# EAGLE schematic Graphic LCD Backpack-v15 (EAGLE 6.4)

## Sheet 1 of 2
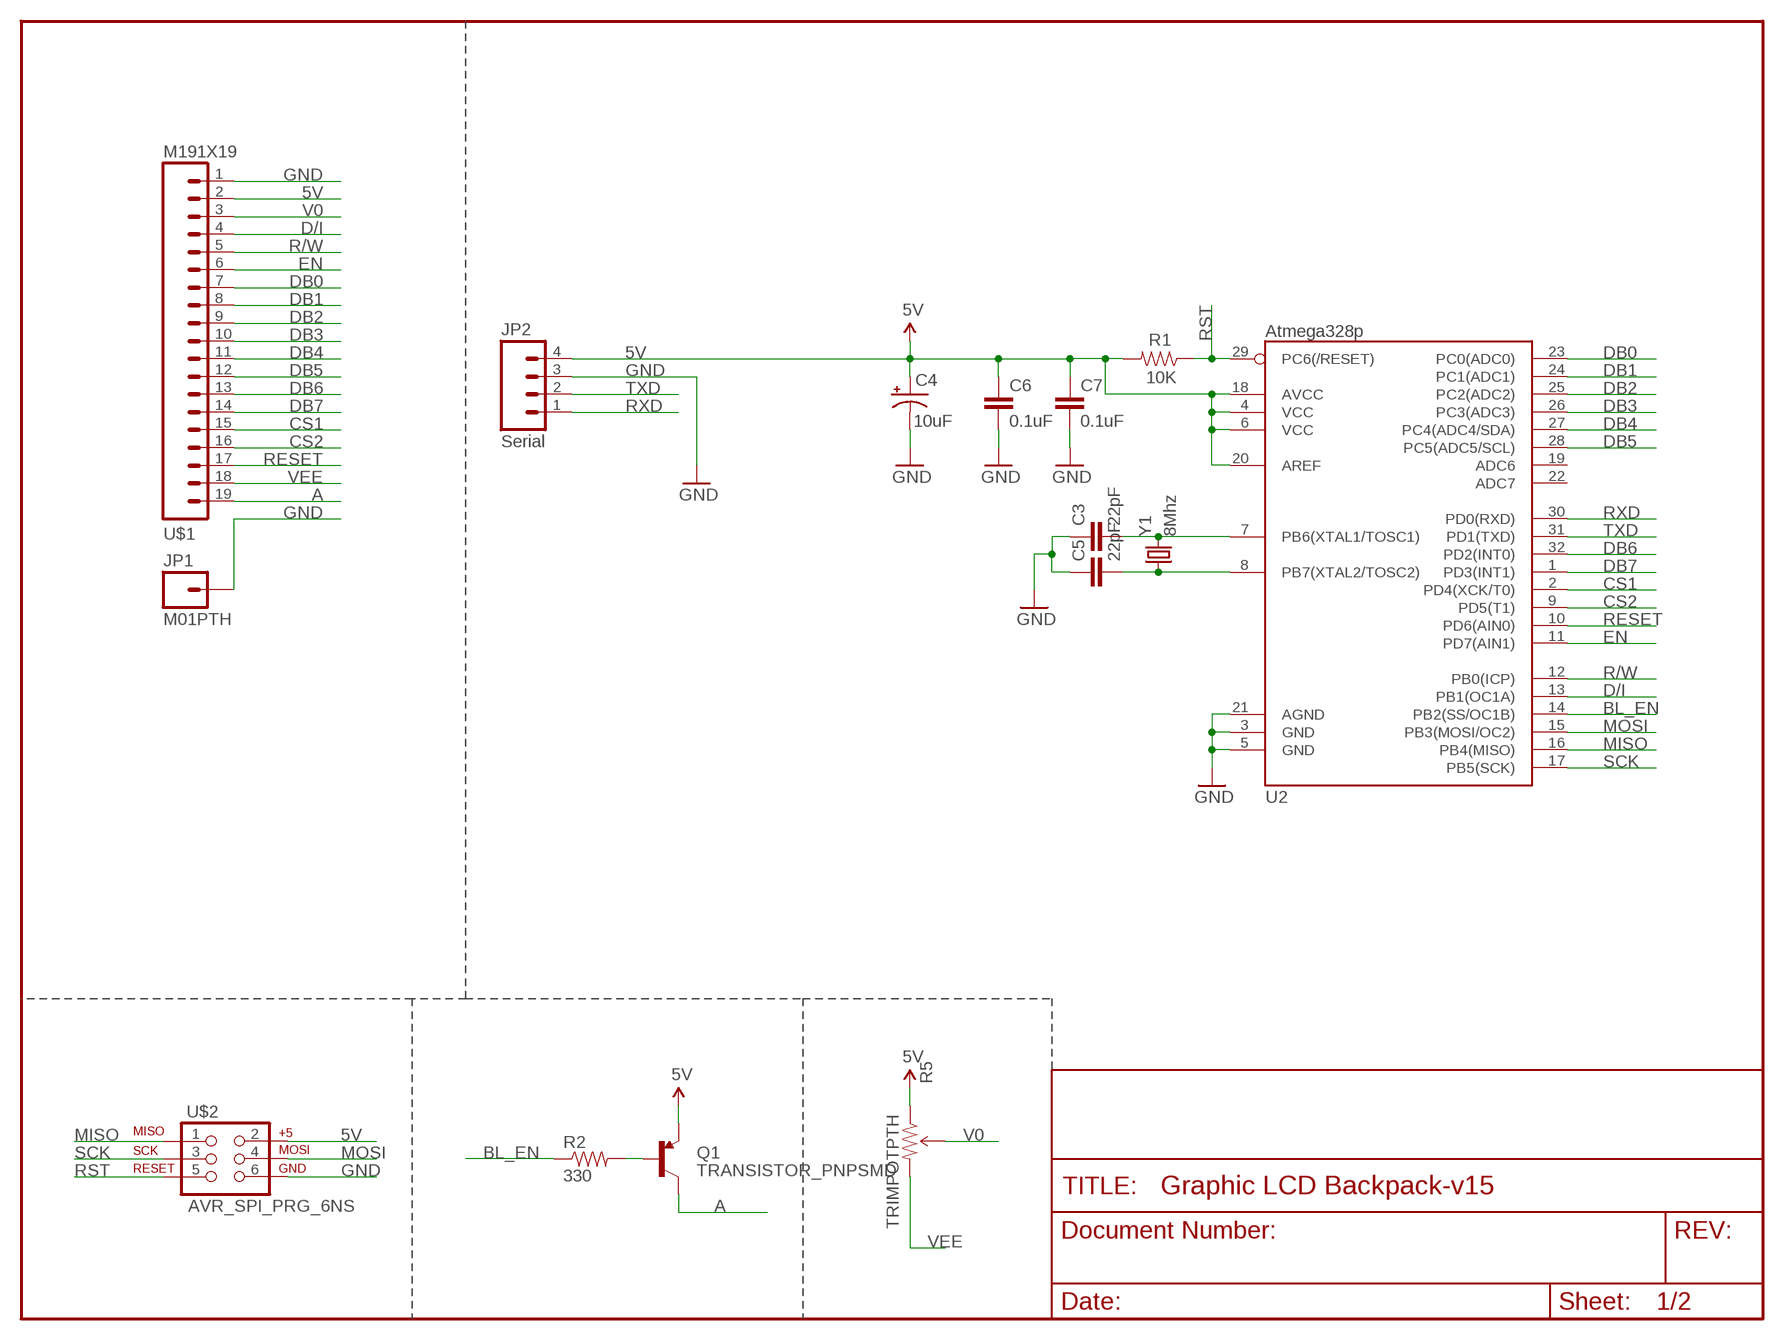
[diagram p0: schematic, sheet 1]

### Parts
C3  22pF  CAP1206  [1206]
C4  10uF  CAP_POL1206  [EIA3216]
C5  22pF  CAP1206  [1206]
C6  0.1uF  CAP1206  [1206]
C7  0.1uF  CAP1206  [1206]
JP1  M01PTH  [1X01]
JP2  Serial  M04PTH  [1X04]
Q1  TRANSISTOR_PNPSMD  [SOT23-3]
R1  10K  RESISTOR  [0805]
R2  330  RESISTOR  [0805]
R5  TRIMPOTPTH  [TRIM_POT_PTH]
U2  Atmega328p  ATMEGA328_SMT  [TQFP32-08]
U$1  M191X19  [1X19]
U$2  AVR_SPI_PRG_6NS  [2X3-NS]
Y1  8Mhz  CRYSTALHC49US  [HC49US]

### Nets
5V: C4.A(+) C6.1 C7.1 JP2.4 Q1.2(E) R1.2 R5.1(CCW) U2.4(VCC) U2.6(VCC) U2.18(AVCC) U2.20(AREF) U$1.2 U$2.2
A: Q1.3(C) U$1.19
BL_EN: R2.1 U2.14(PB2(SS/OC1B))
CS1: U2.2(PD4(XCK/T0)) U$1.15
CS2: U2.9(PD5(T1)) U$1.16
D/I: U2.13(PB1(OC1A)) U$1.4
DB0: U2.23(PC0(ADC0)) U$1.7
DB1: U2.24(PC1(ADC1)) U$1.8
DB2: U2.25(PC2(ADC2)) U$1.9
DB3: U2.26(PC3(ADC3)) U$1.10
DB4: U2.27(PC4(ADC4/SDA)) U$1.11
DB5: U2.28(PC5(ADC5/SCL)) U$1.12
DB6: U2.32(PD2(INT0)) U$1.13
DB7: U2.1(PD3(INT1)) U$1.14
EN: U2.11(PD7(AIN1)) U$1.6
GND: C3.1 C4.C(-) C5.1 C6.2 C7.2 JP1.1 JP2.3 U2.3(GND) U2.5(GND) U2.21(AGND) U$1.1 U$2.6 ; also sheet 2
MISO: U2.16(PB4(MISO)) U$2.1
MOSI: U2.15(PB3(MOSI/OC2)) U$2.4
N$1: Q1.1(B) R2.2
N$2: C3.2 U2.7(PB6(XTAL1/TOSC1)) Y1.2
N$3: C5.2 U2.8(PB7(XTAL2/TOSC2)) Y1.1
R/W: U2.12(PB0(ICP)) U$1.5
RESET: U2.10(PD6(AIN0)) U$1.17
RST: R1.1 U2.29(PC6(/RESET)) U$2.5
RXD: JP2.1 U2.30(PD0(RXD))
SCK: U2.17(PB5(SCK)) U$2.3
TXD: JP2.2 U2.31(PD1(TXD))
V0: R5.2(WIPER) U$1.3
VEE: R5.3(CW) U$1.18
Unconnected: U2.19(ADC6) U2.22(ADC7)

## Sheet 2 of 2
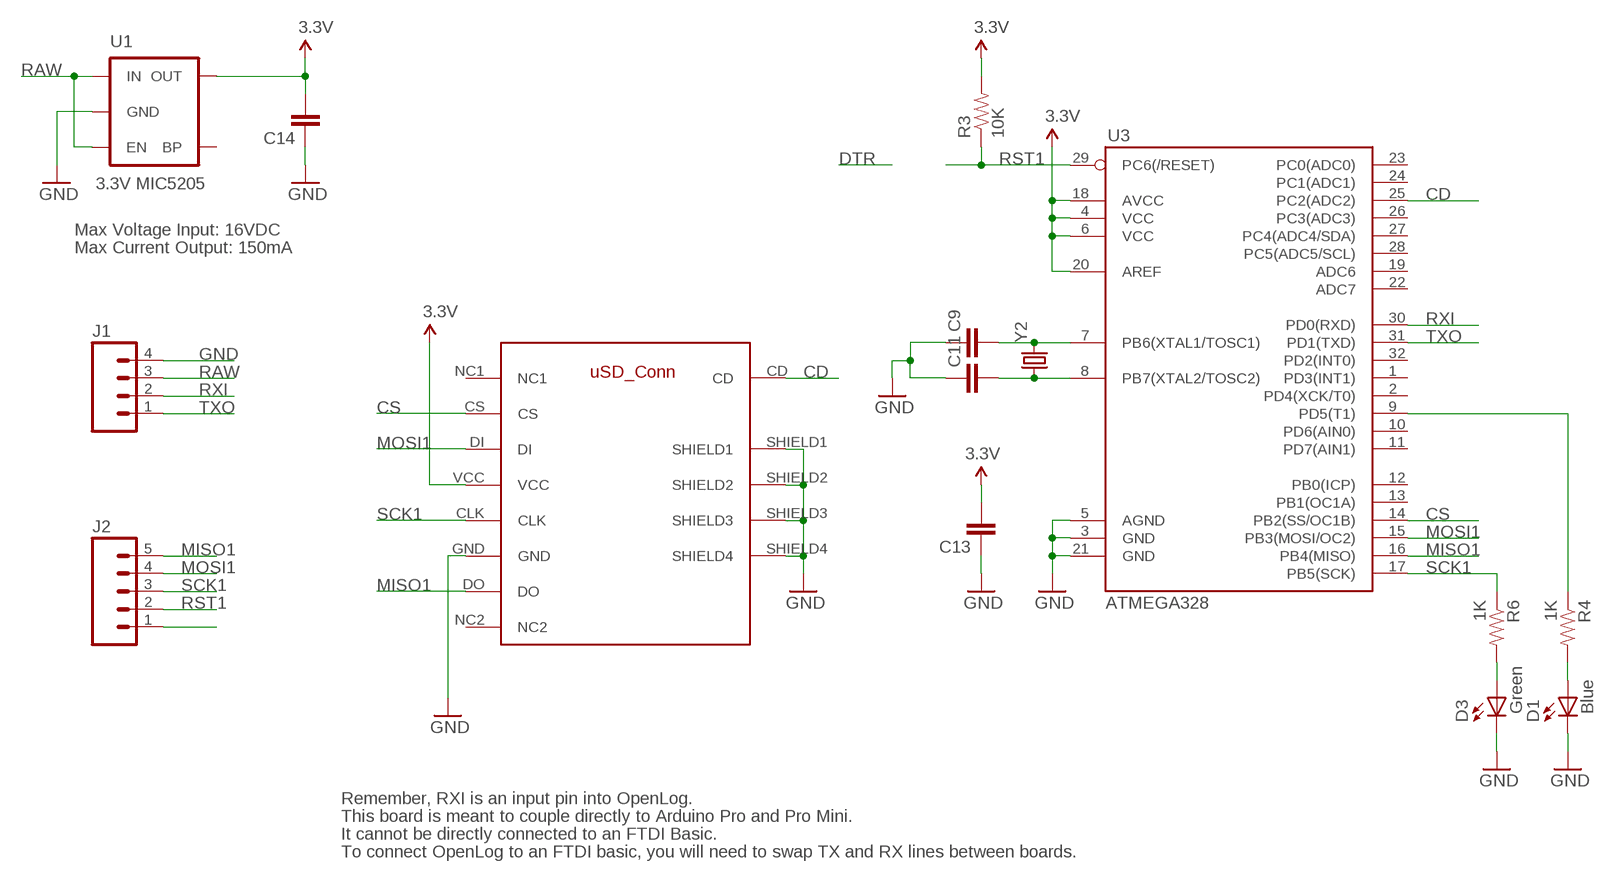
[diagram p1: schematic, sheet 2]

### Parts
C9  CAP1206  [1206]
C11  CAP1206  [1206]
C13  CAP1206  [1206]
C14  CAP1206  [1206]
D1  Blue  LED1206  [LED-1206]
D3  Green  LED1206  [LED-1206]
J1  M04PTH  [1X04]
J2  M05PTH  [1X05]
R3  10K  RESISTOR  [0805]
R4  1K  RESISTOR  [0805]
R6  1K  RESISTOR  [0805]
U1  3.3V MIC5205  V_REG_LDOSMD  [SOT23-5]
U3  ATMEGA328  ATMEGA168  [TQFP32-08]
U$3  USD_CONN  [USD_CONN]
Y2  CRYSTALHC49US  [HC49US]

### Nets
3.3V: C13.2 C14.2 R3.2 U1.5(OUT) U3.4(VCC) U3.6(VCC) U3.18(AVCC) U3.20(AREF) U$3.VCC
CD: U3.25(PC2(ADC2)) U$3.CD
CS: U3.14(PB2(SS/OC1B)) U$3.CS
GND: C9.1 C11.1 C13.1 C14.1 D1.C D3.C J1.4 J2.1 U1.2(GND) U3.3(GND) U3.5(AGND) U3.21(GND) U$3.GND U$3.SHIELD1 U$3.SHIELD2 U$3.SHIELD3 U$3.SHIELD4 ; also sheet 1
MISO1: J2.5 U3.16(PB4(MISO)) U$3.DO
MOSI1: J2.4 U3.15(PB3(MOSI/OC2)) U$3.DI
N$6: D1.A R4.2
N$7: D3.A R6.2
N$8: R4.1 U3.9(PD5(T1))
N$9: C9.2 U3.7(PB6(XTAL1/TOSC1)) Y2.2
N$10: C11.2 U3.8(PB7(XTAL2/TOSC2)) Y2.1
RAW [vcc]: J1.3 U1.1(IN) U1.3(EN)
RST1: J2.2 R3.1 U3.29(PC6(/RESET))
RXI: J1.2 U3.30(PD0(RXD))
SCK1: J2.3 R6.1 U3.17(PB5(SCK)) U$3.CLK
TXO: J1.1 U3.31(PD1(TXD))
Unconnected: U1.4(BP) U3.1(PD3(INT1)) U3.2(PD4(XCK/T0)) U3.10(PD6(AIN0)) U3.11(PD7(AIN1)) U3.12(PB0(ICP)) U3.13(PB1(OC1A)) U3.19(ADC6) U3.22(ADC7) U3.23(PC0(ADC0)) U3.24(PC1(ADC1)) U3.26(PC3(ADC3)) U3.27(PC4(ADC4/SDA)) U3.28(PC5(ADC5/SCL)) U3.32(PD2(INT0)) U$3.NC1 U$3.NC2

### Notes on the sheet
- Max Voltage Input: 16VDC
- Max Current Output: 150mA
- Remember, RXI is an input pin into OpenLog.
- This board is meant to couple directly to Arduino Pro and Pro Mini.
- It cannot be directly connected to an FTDI Basic.
- To connect OpenLog to an FTDI basic, you will need to swap TX and RX lines between boards.

## Library data of the parts
C3 C5-C7 C9 C11 C13 C14 = SparkFun-Capacitors:CAP: Capacitor Standard 0603 ceramic capacitor, and 0.1" leaded capacitor.
C4 = SparkFun:CAP_POL: Capacitor Polarized These are standard SMD and PTH capacitors. Normally 10uF, 47uF, and 100uF in electrolytic and tantalum varieties. Always verify the external diameter of the through hole cap, it varies with capacity, voltage, and manufacturer. The EIA devices should be standard.
D1 D3 = SparkFun:LED: LEDs Standard schematic elements and footprints for 5mm, 3mm, 1206, and 0603 sized LEDs. 5mm - Spark Fun Electronics SKU : COM-00529 (and others)
J1 = SparkFun-Connectors:M04: Header 4 Standard 4-pin 0.1" header. Use with straight break away headers (SKU : PRT-00116), right angle break away headers (PRT-00553), swiss pins (PRT-00743), machine pins (PRT-00117), and female headers (PRT-00115). Molex polarized connector foot print use with SKU : PRT-08231 with associated ...; PROD_ID: CONN-09696
J2 = SparkFun-Connectors:M05: Header 5 Standard 5-pin 0.1" header. Use with straight break away headers (SKU : PRT-00116), right angle break away headers (PRT-00553), swiss pins (PRT-00743), machine pins (PRT-00117), and female headers (PRT-00115). Molex polarized connector foot print use with SKU : PRT-08230 with associated crimp pins and housings.
JP1 = SparkFun-Connectors:M01: Header 1 Standard 1-pin 0.1" header. Use with straight break away headers (SKU : PRT-00116), right angle break away headers (PRT-00553), swiss pins (PRT-00743), machine pins (PRT-00117), and female headers (PRT-00115).
JP2 = SparkFun:M04: Header 4 Standard 4-pin 0.1" header. Use with straight break away headers (SKU : PRT-00116), right angle break away headers (PRT-00553), swiss pins (PRT-00743), machine pins (PRT-00117), and female headers (PRT-00115). Molex polarized connector foot print use with SKU : PRT-08231 with associated ...
Q1 = SparkFun:TRANSISTOR_PNP
R1-R4 R6 = SparkFun:RESISTOR: Resistor Basic schematic elements and footprints for 0603, 1206, and PTH 1/10th watt (small) resistors.
R5 = SparkFun-Electromechanical:TRIMPOT: Various small potentiometers for "set-and-forget" applications
U1 = SparkFun:V_REG_LDO: Voltage Regulator LDO Standard 150mA LDO voltage regulator in SOT-23 layout. Micrel part MIC5205. BP (by-pass) pin is used to lower output noise with 470pF cap.
U2 = SparkFun-DigitalIC:ATMEGA328_SMT: 32-Pin Atmega328 part Commonly used on Arduino compatible boards Available in QFP and QFN packages TQFP is IC-09069 QFN is non-stock; PROD_ID: IC-09069; VALUE: ATMEGA328P
U3 = SparkFun:ATMEGA168
U$1 = SparkFun-Connectors:M19: 1x19 .1" header
U$2 = SparkFun-Connectors:AVR_SPI_PRG_6: AVR ISP 6 Pin This is the reduced ISP connector for AVR programming. Common on Arduino. This footprint will take up less PCB space and can be used with a 10-pin to 6-pin adapter such as SKU: BOB-08508 **Special note about "TEST_POINT" package. The stop mask is on the top side, so if you want your programming test points to be on the bottom of your board, make sure to place this package on the bottom side of the board. This also ensure that the orientation to program from the bottom side will be correct.
U$3 = myeagle:USD_CONN
Y1 Y2 = SparkFun-FreqCtrl:CRYSTAL: Various standard crystals. Proven footprints.

## Net classes
0 default: width 0.178 mm
1 vcc: width 0.203 mm